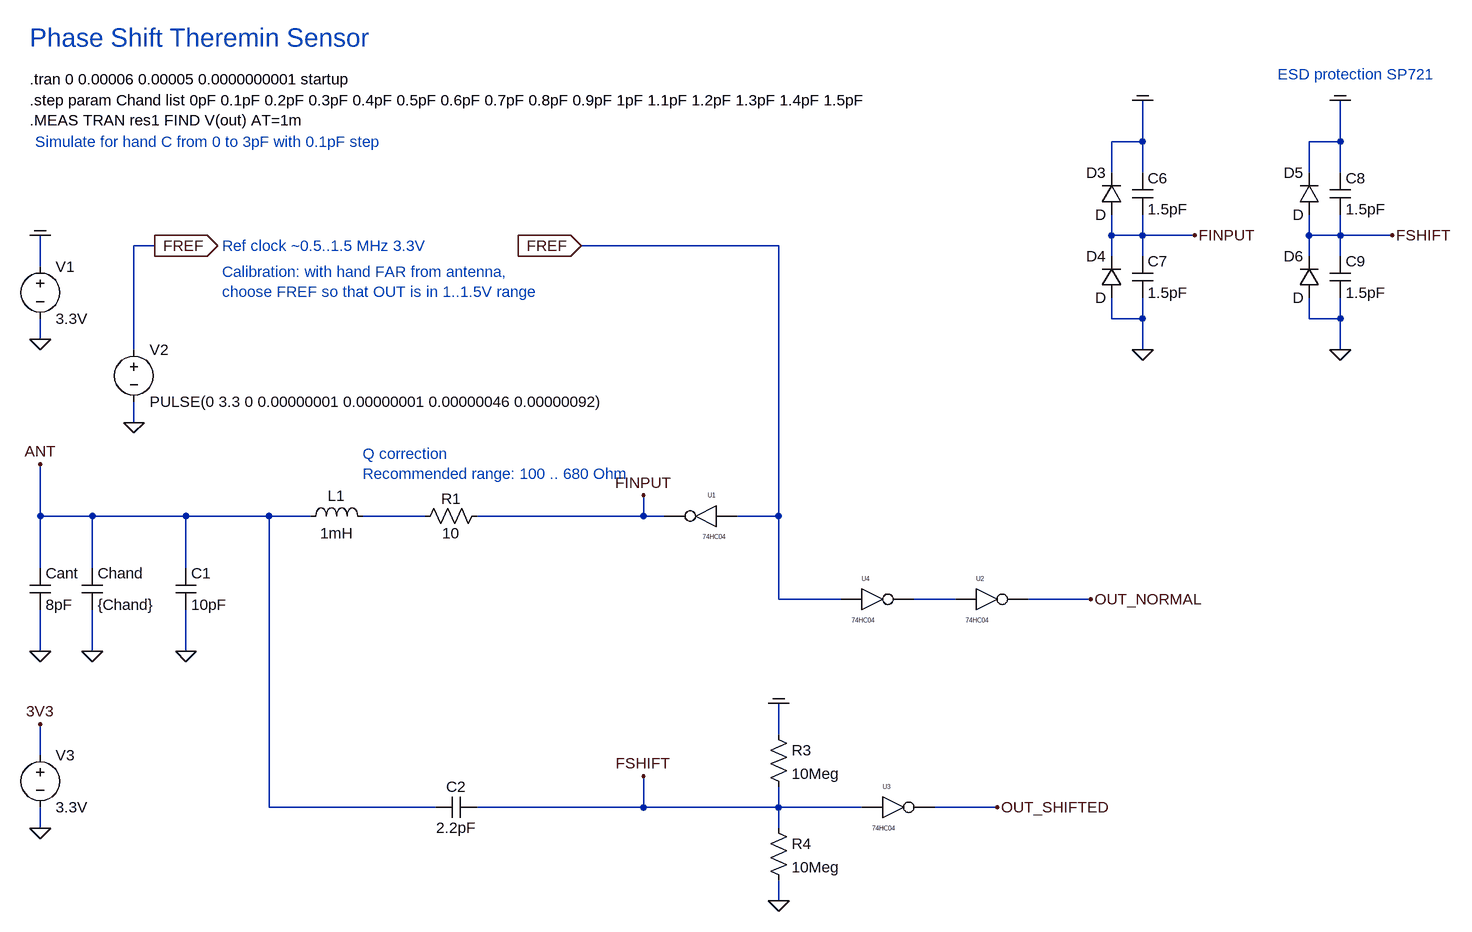
[diagram p0: schematic phase_shift_sensor_v2.asc]
phase_shift_sensor_v2.asc, the LTspice schematic file:
Version 4
SHEET 1 3724 1652
WIRE 1744 -208 1744 -272
WIRE 1744 -208 1696 -208
WIRE 2048 -208 2048 -272
WIRE 2048 -208 2000 -208
WIRE 1696 -160 1696 -208
WIRE 1744 -160 1744 -208
WIRE 2000 -160 2000 -208
WIRE 2048 -160 2048 -208
WIRE 1696 -64 1696 -96
WIRE 1744 -64 1744 -96
WIRE 1744 -64 1696 -64
WIRE 1824 -64 1744 -64
WIRE 2000 -64 2000 -96
WIRE 2048 -64 2048 -96
WIRE 2048 -64 2000 -64
WIRE 2128 -64 2048 -64
WIRE 224 -48 192 -48
WIRE 1184 -48 880 -48
WIRE 1696 -32 1696 -64
WIRE 1744 -32 1744 -64
WIRE 2000 -32 2000 -64
WIRE 2048 -32 2048 -64
WIRE 48 -16 48 -64
WIRE 1696 64 1696 32
WIRE 1744 64 1744 32
WIRE 1744 64 1696 64
WIRE 2000 64 2000 32
WIRE 2048 64 2048 32
WIRE 2048 64 2000 64
WIRE 48 96 48 64
WIRE 192 112 192 -48
WIRE 1744 112 1744 64
WIRE 2048 112 2048 64
WIRE 192 224 192 192
WIRE 48 368 48 288
WIRE 128 368 48 368
WIRE 272 368 128 368
WIRE 400 368 272 368
WIRE 464 368 400 368
WIRE 640 368 544 368
WIRE 976 368 976 336
WIRE 976 368 720 368
WIRE 1008 368 976 368
WIRE 1184 368 1184 -48
WIRE 1184 368 1120 368
WIRE 48 448 48 368
WIRE 128 448 128 368
WIRE 272 448 272 368
WIRE 1184 496 1184 368
WIRE 1280 496 1184 496
WIRE 1456 496 1392 496
WIRE 1664 496 1568 496
WIRE 48 576 48 512
WIRE 128 576 128 512
WIRE 272 576 272 512
WIRE 1184 704 1184 656
WIRE 48 736 48 688
WIRE 400 816 400 368
WIRE 656 816 400 816
WIRE 976 816 976 768
WIRE 976 816 720 816
WIRE 1184 816 1184 784
WIRE 1184 816 976 816
WIRE 1312 816 1184 816
WIRE 1520 816 1424 816
WIRE 48 848 48 816
WIRE 1184 848 1184 816
WIRE 1184 960 1184 928
FLAG 48 96 0
FLAG 224 -48 FREF
IOPIN 224 -48 Out
FLAG 192 224 0
FLAG 48 288 ANT
FLAG 48 576 0
FLAG 128 576 0
FLAG 880 -48 FREF
IOPIN 880 -48 In
FLAG 1184 960 0
FLAG 48 -64 COM
FLAG 1184 656 COM
FLAG 1744 112 0
FLAG 1744 -272 COM
FLAG 1824 -64 FINPUT
FLAG 2048 112 0
FLAG 2048 -272 COM
FLAG 2128 -64 FSHIFT
FLAG 976 768 FSHIFT
FLAG 976 336 FINPUT
FLAG 48 848 0
FLAG 48 688 3V3
FLAG 1664 496 OUT_NORMAL
FLAG 1520 816 OUT_SHIFTED
FLAG 272 576 0
SYMBOL voltage 48 -32 R0
WINDOW 123 0 0 Left 2
WINDOW 39 0 0 Left 2
SYMATTR InstName V1
SYMATTR Value 3.3V
SYMBOL voltage 192 96 R0
WINDOW 123 0 0 Left 2
WINDOW 39 0 0 Left 2
SYMATTR InstName V2
SYMATTR Value PULSE(0 3.3 0 0.00000001 0.00000001 0.00000046 0.00000092)
SYMBOL ind 448 384 R270
WINDOW 0 32 56 VTop 2
WINDOW 3 5 56 VBottom 2
SYMATTR InstName L1
SYMATTR Value 1mH
SYMATTR SpiceLine Ipk=0.01 Rser=18.958 Rpar=2.865Meg Cpar=1.322pF
SYMBOL cap 32 448 R0
SYMATTR InstName Cant
SYMATTR Value 8pF
SYMBOL cap 112 448 R0
SYMATTR InstName Chand
SYMATTR Value {Chand}
SYMBOL res 736 352 R90
WINDOW 0 5 56 VBottom 2
WINDOW 3 27 56 VTop 2
SYMATTR InstName R1
SYMATTR Value 10
SYMBOL cap 656 832 R270
WINDOW 0 32 32 VTop 2
WINDOW 3 0 32 VBottom 2
SYMATTR InstName C2
SYMATTR Value 2.2pF
SYMBOL res 1168 688 R0
SYMATTR InstName R3
SYMATTR Value 10Meg
SYMBOL res 1168 832 R0
SYMATTR InstName R4
SYMATTR Value 10Meg
SYMBOL diode 1712 -96 R180
WINDOW 0 24 64 Left 2
WINDOW 3 24 0 Left 2
SYMATTR InstName D3
SYMBOL diode 1712 32 R180
WINDOW 0 24 64 Left 2
WINDOW 3 24 0 Left 2
SYMATTR InstName D4
SYMBOL cap 1728 -160 R0
SYMATTR InstName C6
SYMATTR Value 1.5pF
SYMBOL cap 1728 -32 R0
SYMATTR InstName C7
SYMATTR Value 1.5pF
SYMBOL diode 2016 -96 R180
WINDOW 0 24 64 Left 2
WINDOW 3 24 0 Left 2
SYMATTR InstName D5
SYMBOL diode 2016 32 R180
WINDOW 0 24 64 Left 2
WINDOW 3 24 0 Left 2
SYMATTR InstName D6
SYMBOL cap 2032 -160 R0
SYMATTR InstName C8
SYMATTR Value 1.5pF
SYMBOL cap 2032 -32 R0
SYMATTR InstName C9
SYMATTR Value 1.5pF
SYMBOL voltage 48 720 R0
WINDOW 123 0 0 Left 2
WINDOW 39 0 0 Left 2
SYMATTR InstName V3
SYMATTR Value 3.3V
SYMBOL EXTRA\\74HC\\74hc04 1072 304 M0
SYMATTR InstName U1
SYMATTR SpiceLine VCC=3.3  SPEED=1.0  TRIPDT=1e-9
SYMBOL EXTRA\\74HC\\74hc04 1504 432 R0
SYMATTR InstName U2
SYMATTR SpiceLine VCC=3.3  SPEED=1.0  TRIPDT=1e-9
SYMBOL EXTRA\\74HC\\74hc04 1360 752 R0
SYMATTR InstName U3
SYMATTR SpiceLine VCC=3.3  SPEED=1.0  TRIPDT=1e-9
SYMBOL EXTRA\\74HC\\74hc04 1328 432 R0
SYMATTR InstName U4
SYMATTR SpiceLine VCC=3.3  SPEED=1.0  TRIPDT=1e-9
SYMBOL cap 256 448 R0
SYMATTR InstName C1
SYMATTR Value 10pF
TEXT 32 -304 Left 2 !.tran 0 0.00006 0.00005 0.0000000001 startup
TEXT 32 -272 Left 2 !.step param Chand list 0pF 0.1pF 0.2pF 0.3pF 0.4pF 0.5pF 0.6pF 0.7pF 0.8pF 0.9pF 1pF 1.1pF 1.2pF 1.3pF 1.4pF 1.5pF\n.MEAS TRAN res1 FIND V(out) AT=1m
TEXT 328 -48 Left 2 ;Ref clock ~0.5..1.5 MHz 3.3V
TEXT 32 -368 Left 4 ;Phase Shift Theremin Sensor
TEXT 544 272 Left 2 ;Q correction\nRecommended range: 100 .. 680 Ohm
TEXT 1952 -312 Left 2 ;ESD protection SP721
TEXT 328 -8 Left 2 ;Calibration: with hand FAR from antenna,\nchoose FREF so that OUT is in 1..1.5V range
TEXT 40 -208 Left 2 ;Simulate for hand C from 0 to 3pF with 0.1pF step

The netlist it stands for:
* phase_shift_sensor_v2.asc
V1 COM 0 3.3V
V2 FREF 0 PULSE(0 3.3 0 0.00000001 0.00000001 0.00000046 0.00000092)
L1 ANT N001 1mH Ipk=0.01 Rser=18.958 Rpar=2.865Meg Cpar=1.322pF
Cant ANT 0 8pF
Chand ANT 0 {Chand}
R1 FINPUT N001 10
C2 ANT FSHIFT 2.2pF
R3 COM FSHIFT 10Meg
R4 FSHIFT 0 10Meg
D3 FINPUT COM D
D4 0 FINPUT D
C6 COM FINPUT 1.5pF
C7 FINPUT 0 1.5pF
D5 FSHIFT COM D
D6 0 FSHIFT D
C8 COM FSHIFT 1.5pF
C9 FSHIFT 0 1.5pF
V3 3V3 0 3.3V
XU1 FREF FINPUT VCC 0 74HC04 VCC=3.3  SPEED=1.0  TRIPDT=1e-9  ; pins A Y
XU2 N002 OUT_NORMAL VCC 0 74HC04 VCC=3.3  SPEED=1.0  TRIPDT=1e-9  ; pins A Y
XU3 FSHIFT OUT_SHIFTED VCC 0 74HC04 VCC=3.3  SPEED=1.0  TRIPDT=1e-9  ; pins A Y
XU4 FREF N002 VCC 0 74HC04 VCC=3.3  SPEED=1.0  TRIPDT=1e-9  ; pins A Y
C1 ANT 0 10pF
.model D D
.lib standard.dio
.tran 0 0.00006 0.00005 0.0000000001 startup
.step param Chand list 0pF 0.1pF 0.2pF 0.3pF 0.4pF 0.5pF 0.6pF 0.7pF 0.8pF 0.9pF 1pF 1.1pF 1.2pF 1.3pF 1.4pF 1.5pF
.MEAS TRAN res1 FIND V(out) AT=1m
* Ref clock ~0.5..1.5 MHz 3.3V
* Phase Shift Theremin Sensor
* Q correction
* Recommended range: 100 .. 680 Ohm
* ESD protection SP721
* Calibration: with hand FAR from antenna,
* choose FREF so that OUT is in 1..1.5V range
* Simulate for hand C from 0 to 3pF with 0.1pF step
.lib 74HC.lib
.backanno
.end